# EAGLE design Blinder_v1 (EAGLE 5.11)
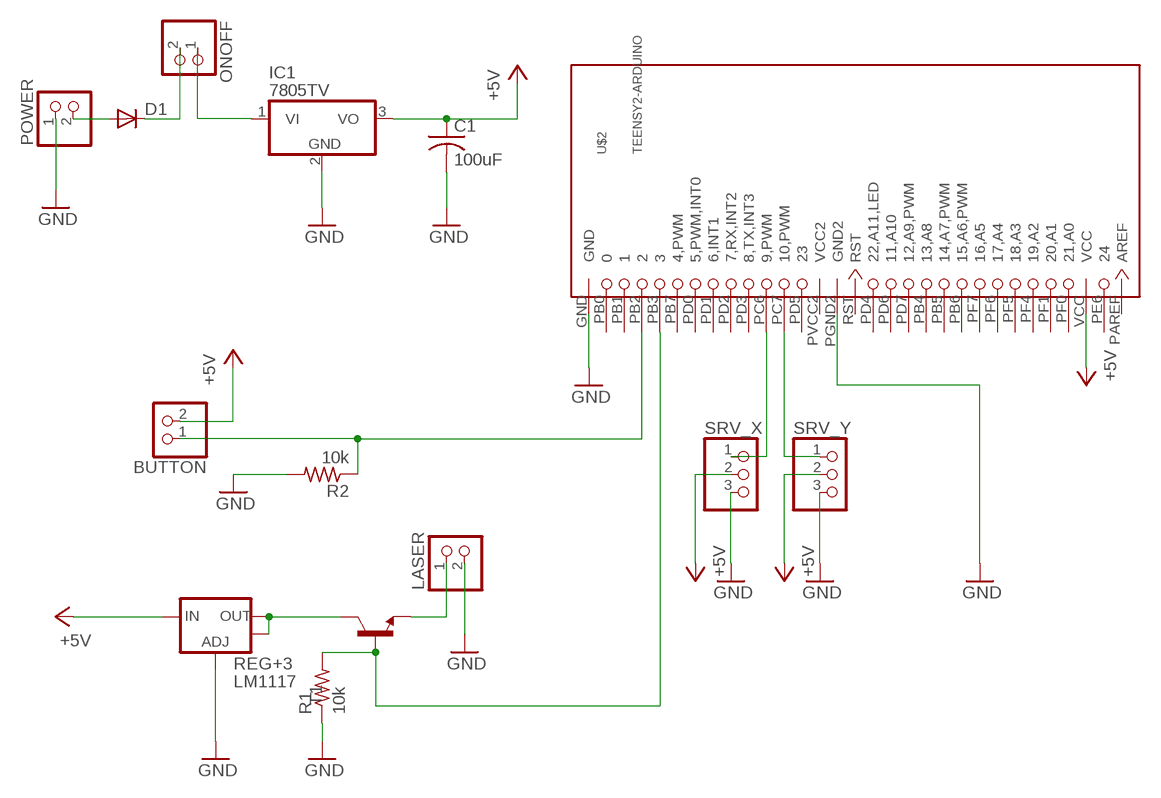
[diagram p0: schematic, sheet 1]

## Parts
BUTTON  PINHD-1X2/90  [1X02/90]
C1  100uF  C-US025-050X050  [C025-050X050]
D1  DIODE-D-7.5  [D-7.5]
IC1  7805TV  [TO220V]
LASER  PINHD-1X2/90  [1X02/90]
ONOFF  PINHD-1X2/90  [1X02/90]
POWER  PINHD-1X2/90  [1X02/90]
R1  10k  R-US_0204/5  [0204/5]
R2  10k  R-US_0204/5  [0204/5]
REG+3  LM1117  V_REG_LM1117SOT223  [SOT223]
SRV_X  PINHD-1X3/90  [1X03/90]
SRV_Y  PINHD-1X3/90  [1X03/90]
T1  -NPN-TO220V  [TO220V]
U$2  TEENSY2-ARDUINO  [TEENSY2]

## Nets
+5V: BUTTON.2 C1.1 IC1.3(VO) REG+3.3(IN) SRV_X.2 SRV_Y.2 U$2.VCC
GND: C1.2 IC1.2(GND) LASER.2 POWER.1 R1.1 R2.2 REG+3.1(ADJ) SRV_X.3 SRV_Y.3 U$2.GND U$2.PGND2(GND2)
N$1: D1.A POWER.2
N$2: REG+3.2(OUT) REG+3.4(OUT) T1.2(C)
N$3: LASER.1 T1.3(E)
N$4: R1.2 T1.1(B) U$2.PB3
N$5: SRV_X.1 U$2.PC6(9,PWM)
N$6: SRV_Y.1 U$2.PC7(10,PWM)
N$7: D1.C ONOFF.2
N$8: IC1.1(VI) ONOFF.1
N$9: BUTTON.1 R2.1 U$2.PB2
Unconnected: U$2.PAREF(AREF) U$2.PB0 U$2.PB1 U$2.PB4(13,A8) U$2.PB5(14,A7,PWM) U$2.PB6(15,A6,PWM) U$2.PB7(4,PWM) U$2.PD0(5,PWM,INT0) U$2.PD1(6,INT1) U$2.PD2(7,RX,INT2) U$2.PD3(8,TX,INT3) U$2.PD4(22,A11,LED) U$2.PD5 U$2.PD6(11,A10) U$2.PD7(12,A9,PWM) U$2.PE6 U$2.PF0(21,A0) U$2.PF1(20,A1) U$2.PF4(19,A2) U$2.PF5(18,A3) U$2.PF6(17,A4) U$2.PF7(16,A5) U$2.RST

## Power pins joined to a net without a drawn wire
VCC2: U$2.PVCC2(VCC2)

## Library data of the parts
BUTTON LASER ONOFF POWER = pinhead:PINHD-1X2: PIN HEADER
C1 = rcl:C-US: CAPACITOR, American symbol
D1 = diode:DIODE-: DIODE
IC1 = linear:78*: Positive VOLTAGE REGULATOR Source: http://cache.national.com/ds/LM/LM78L05.pdf http://www.fairchildsemi.com/ds/LM/LM7805.pdf
R1 R2 = rcl:R-US_: RESISTOR, American symbol
REG+3 = SparkFun:V_REG_LM1117: Voltage Regulator LM1117 Standard adjustable voltage regulator but in SMD form. Spark Fun Electronics SKU : COM-00595
SRV_X SRV_Y = pinhead:PINHD-1X3: PIN HEADER
T1 = transistor:*-NPN-: NPN Transistror BF959 corrected 2008.03.06
U$2 = teensy2:TEENSY2-ARDUINO

## Board
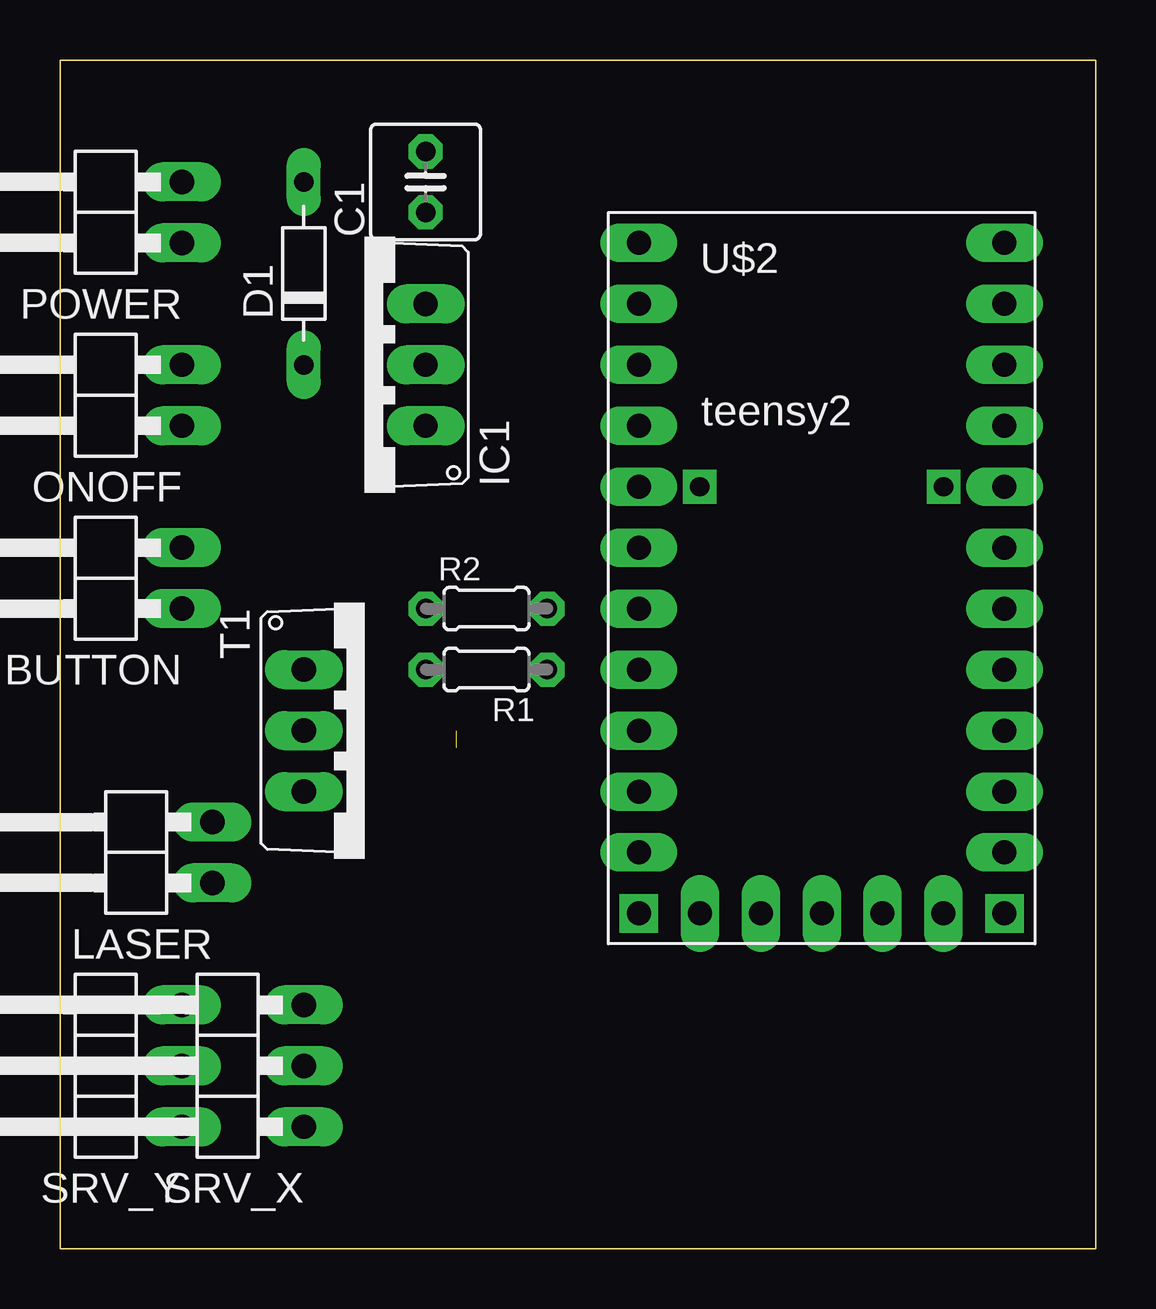
[diagram p1: board, top side]
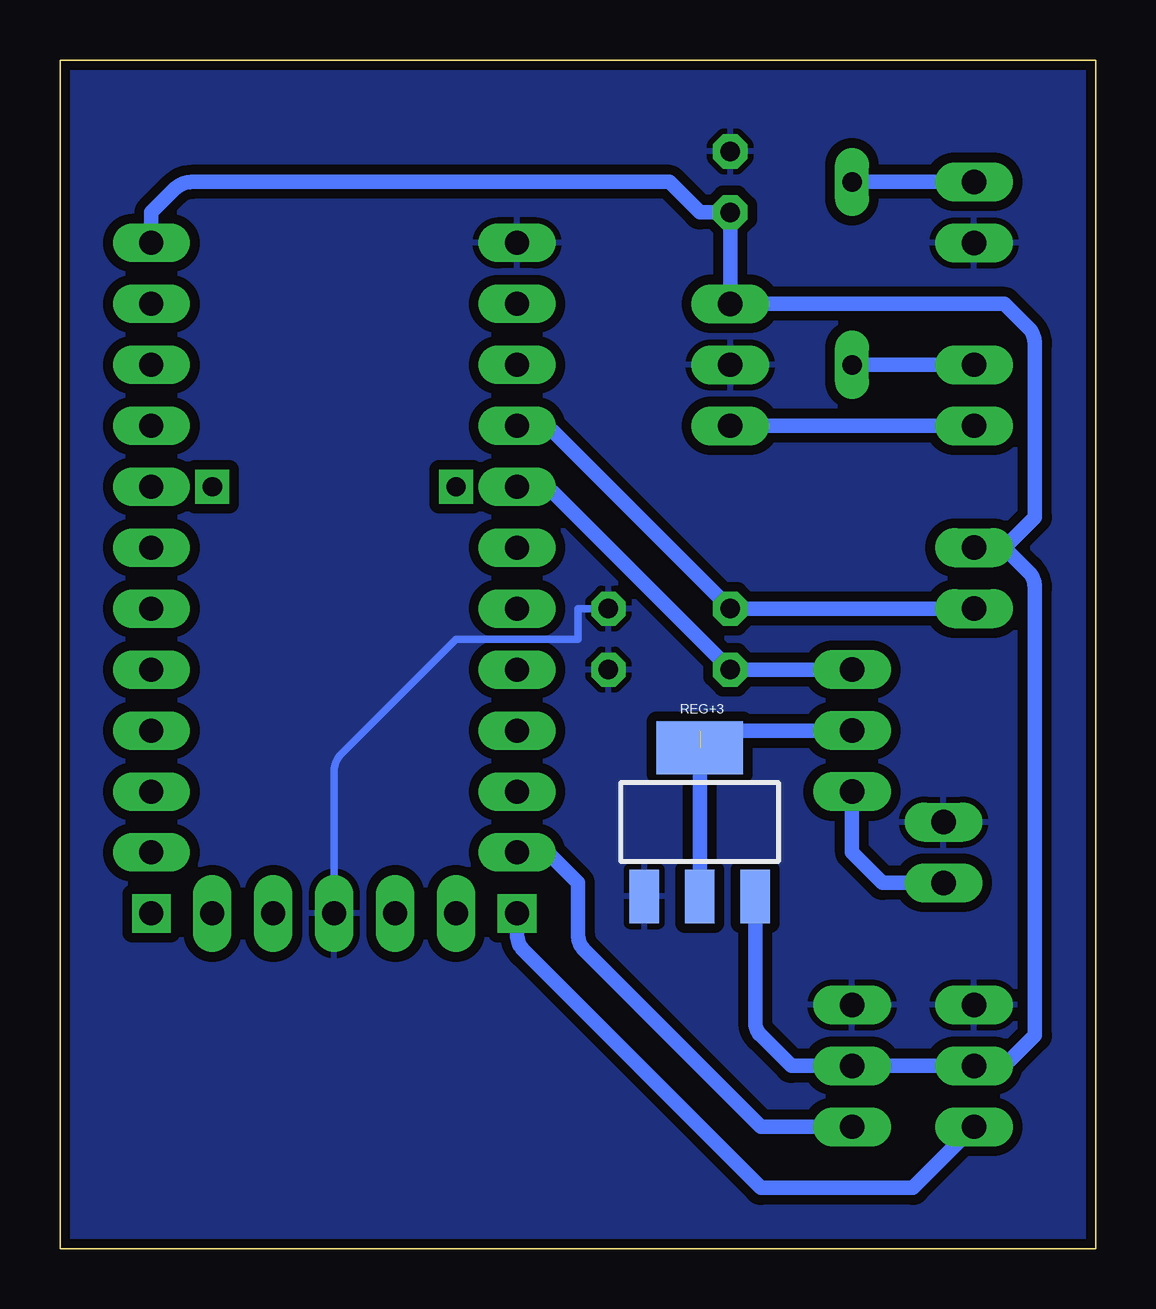
[diagram p2: board, bottom side, seen from below]

Size 43.18 x 49.53 mm. Coordinates in mm from the lower left corner, seen from the top.
Outline: 0,0 43.18,0 43.18,49.53 0,49.53 0,0
Copper layers (1*16): Top 0.0356mm / dielectric 1.5011mm / Bottom 0.0356mm
Design rules "SparkFun-mod": minimum track width 8mil, minimum drill 20mil, track to track 12mil, track to pad 12mil, pad to pad 8mil, via to via 8mil, smd to smd 8mil, copper to edge 12mil, drill to drill 8mil, minimum pad ring 12mil, minimum via ring 10mil, stop-mask expansion 4mil, vias tented up to drill 25mil, thermal gap 10mil
Milling: 4 lines

### Footprints (pad centres in the part's own frame; a part is rotated, then mirrored left to right if it is on the bottom)
1X02/90 = drill 1.016 long: 1 -1.27,-3.81; 2 1.27,-3.81
C025-050X050 = drill 0.813 octagon: 1 -1.27,0; 2 1.27,0
D-7.5 = drill 0.813 long: A 3.81,0; C -3.81,0
TO220V = drill 1.016 long: 1 -2.54,-2.54; 2 0,-2.54; 3 2.54,-2.54
0204/5 = drill 0.813 octagon: 1 -2.54,0; 2 2.54,0
SOT223 = smd 1.219 x 2.235: 1 -2.311,-3.099; 2 0,-3.099; 3 2.311,-3.099 | smd 3.6 x 2.2: 4 0,3.099
1X03/90 = drill 1.016 long: 1 -2.54,-3.81; 2 0,-3.81; 3 2.54,-3.81
TEENSY2 = drill 1 long: GND 12.7,21.59; PB0 12.7,19.05; PB1 12.7,16.51; PB2 12.7,13.97; PB3 12.7,11.43; PB4 27.94,-1.27; PB5 27.94,1.27; PB6 27.94,3.81; PB7 12.7,8.89; PC6 12.7,-3.81; PD0 12.7,6.35; PD1 12.7,3.81; PD2 12.7,1.27; PD3 12.7,-1.27; PD4 25.4,-6.35; PD5 15.24,-6.35; PD7 27.94,-3.81; PF0 27.94,19.05; PF1 27.94,16.51; PF4 27.94,13.97; PF5 27.94,11.43; PF6 27.94,8.89; PF7 27.94,6.35; PGND2 20.32,-6.35; PVCC2 17.78,-6.35; RST 22.86,-6.35; VCC 27.94,21.59 | drill 0.8 square: PAREF 25.4,11.43; PE6 15.24,11.43 | drill 1 square: PC7 12.7,-6.35; PD6 27.94,-6.35

### Placement (x,y rotation side)
BUTTON  1.27,27.94 90 top
C1  15.24,44.45 90 top
D1  10.16,40.64 90 top
IC1  12.7,36.83 90 top
LASER  2.54,16.51 90 top
ONOFF  1.27,35.56 90 top
POWER  1.27,43.18 90 top
R1  17.78,24.13 180 top
R2  17.78,26.67 0 top
REG+3  16.51,17.78 0 bottom
SRV_X  6.35,7.62 90 top
SRV_Y  1.27,7.62 90 top
T1  12.7,21.59 270 top
U$2  11.43,20.32 0 top

### Tracks (layer width: path | path; a pad name or v marks a point on that pad's centre or on a via)
+5V
  Bottom 0.61: U$2.VCC 39.37,43.18 38.39,44.16 arc45 37.69,44.45 17.78,44.45 16.51,43.18 C1.1 IC1.3 3.81,39.37 2.83,38.39 arc45 2.54,37.69 2.54,30.48 3.52,29.5 arc45 4.22,29.21 BUTTON.2 3.81,29.21 2.83,28.23 arc45 2.54,27.53 2.54,8.89 3.52,7.91 arc45 4.22,7.62 SRV_Y.2 SRV_X.2 12.7,7.62 13.97,8.89 arc45 14.2,9.44 REG+3.3
GND
  Bottom 0.305: R2.2 21.59,26.67 21.59,25.4 26.67,25.4 31.46,20.61 arc-45 31.75,19.91 U$2.PGND2
  pour Bottom (isolate 0.406): 0,49.53 42.18,49.53 arc-90 43.18,48.53 43.18,0 1,0 arc-90 0,1
N$1
  Bottom 0.61: POWER.2 D1.A
N$2  (1 unrouted)
  Bottom 0.61: T1.2 16.51,21.59 REG+3.2
N$3
  Bottom 0.61: LASER.1 8.89,15.24 10.16,16.51 T1.3
N$4
  Bottom 0.61: U$2.PB3 23.27,31.75 arc45 22.57,31.46 R1.2 T1.1
N$5
  Bottom 0.61: SRV_X.1 13.97,5.08 21.3,12.41 arc45 21.59,13.11 21.59,15.24 22.86,16.51 U$2.PC6
N$6
  Bottom 0.61: SRV_Y.1 7.62,2.54 13.97,2.54 23.84,12.41 arc45 24.13,13.11 U$2.PC7
N$7
  Bottom 0.61: ONOFF.2 D1.C
N$8
  Bottom 0.61: ONOFF.1 IC1.1
N$9
  Bottom 0.61: BUTTON.1 R2.1 22.57,34 arc-45 23.27,34.29 U$2.PB2